# EAGLE design mcb_com14 (EAGLE 5.09)
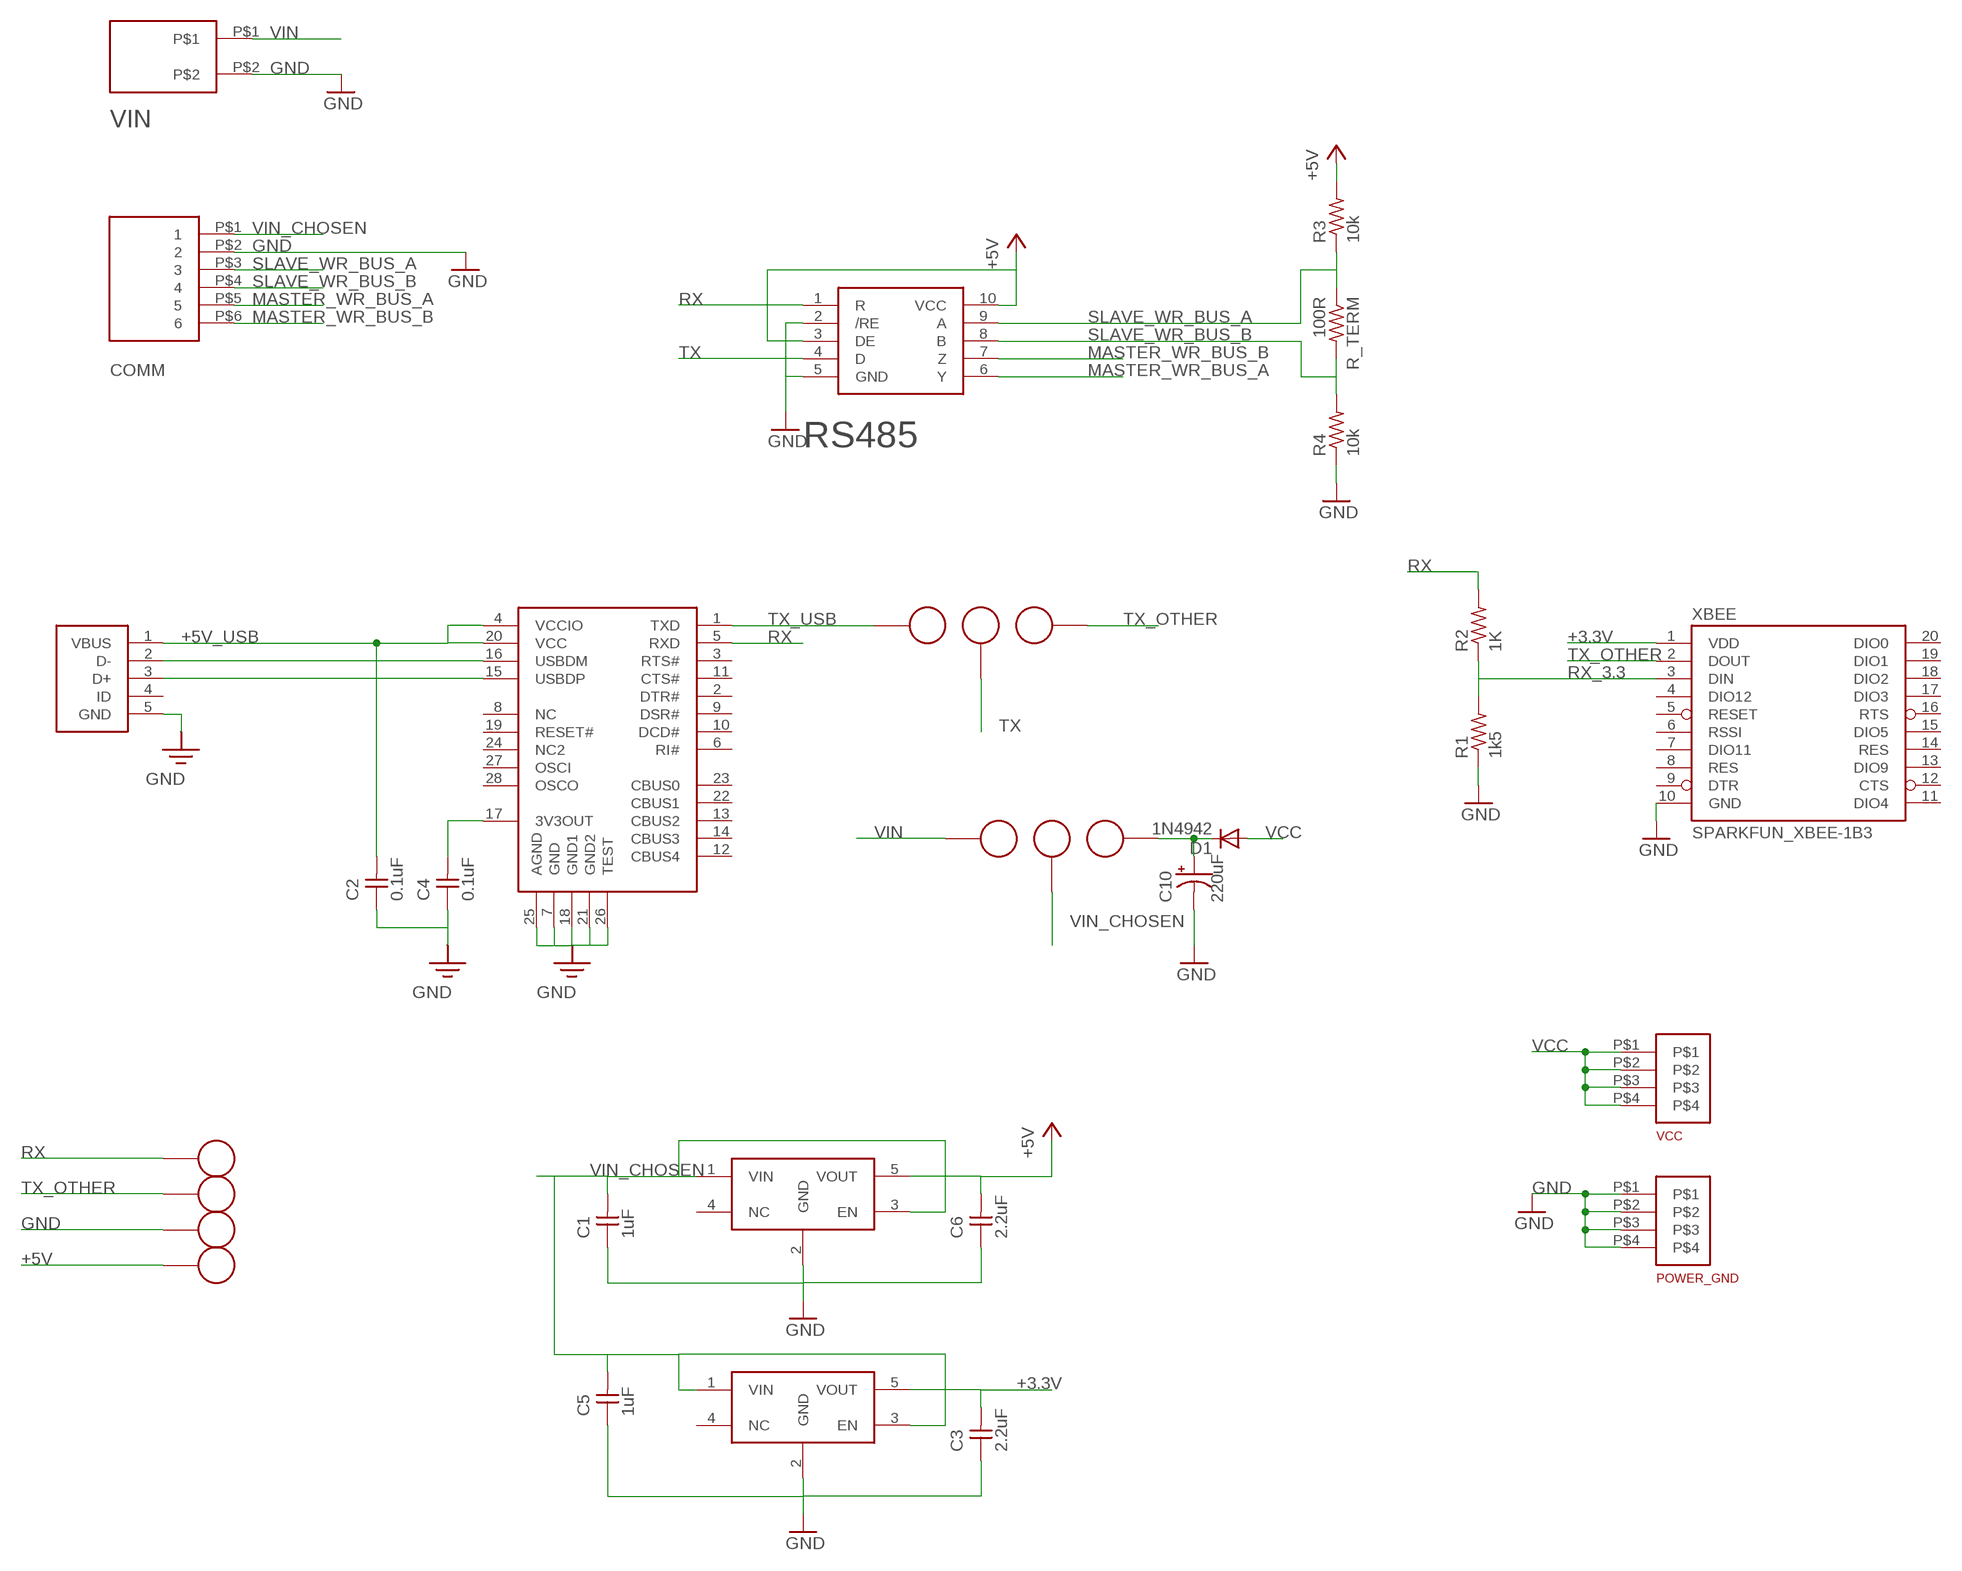
[diagram p0: schematic, sheet 1]

## Parts
3.3V_REG  MIC5235  [SOT-23-5]
5V1  CONNECTOR_TV  [CONNECTOR_TV]
5V_REG  MIC5235  [SOT-23-5]
5V_USB1  CONNECTOR_TV  [CONNECTOR_TV]
5V_VREG1  CONNECTOR_TV  [CONNECTOR_TV]
+5V  CONNECTOR_TV  [CONNECTOR_TV]
C1  1uF  CAPACITOR0805  [0805@1]
C2  0.1uF  CAPACITOR0805  [0805@1]
C3  2.2uF  CAPACITOR0805  [0805@1]
C4  0.1uF  CAPACITOR0805  [0805@1]
C5  1uF  CAPACITOR0805  [0805@1]
C6  2.2uF  CAPACITOR0805  [0805@1]
C10  220uF  CAP-EMVY350ADA221MHA0G  [HAO]
COMM  6PIN-RIBBONCABLE-BOARDHEADER  [6PIN-HEADER-DUALROW]
D1  1N4942  [DO41-10]
FT323R  FT232R  [SSOP-28]
GND  CONNECTOR_TV  [CONNECTOR_TV]
POWER_GND  SCREW_TERMINAL_7700K  [SCREW_TERM_7700K]
R1  1k5  RESISTOR0603  [0603]
R2  1K  RESISTOR0603  [0603]
R3  10k  RESISTOR0603  [0603]
R4  10k  RESISTOR0603  [0603]
R_TERM  100R  RESISTOR0603  [0603]
RS485  RS485-SN65HVD3086EDGSR  [MSOP-10]
RX1  CONNECTOR_TV  [CONNECTOR_TV]
TX  CONNECTOR_TV  [CONNECTOR_TV]
TX1  CONNECTOR_TV  [CONNECTOR_TV]
TX_FTDI  CONNECTOR_TV  [CONNECTOR_TV]
TX_TTL  CONNECTOR_TV  [CONNECTOR_TV]
USB_CONN  MINIUSB  [UX60-MINI-USB]
VCC  SCREW_TERMINAL_7700K  [SCREW_TERM_7700K]
VIN  2PIN-3.81MM-TERMINAL-BLOCK  [2PIN-TERMINAL-BLOCK-SMALLER]
XBEE  SPARKFUN_XBEE-1B3  [SPARKFUN_XBEE-SMD]

## Nets
+3.3V: 3.3V_REG.5(VOUT) C3.2 XBEE.1(VDD)
+5V: 5V_REG.5(VOUT) +5V.P$1 C6.2 R3.2 RS485.3(DE) RS485.10(VCC)
+5V_USB: C2.2 FT323R.4(VCCIO) FT323R.20(VCC) USB_CONN.1(VBUS)
D+: FT323R.15(USBDP) USB_CONN.3(D+)
D-: FT323R.16(USBDM) USB_CONN.2(D-)
GND: 3.3V_REG.2(GND) 5V_REG.2(GND) C1.1 C2.1 C3.1 C4.1 C5.1 C6.1 C10.- COMM.P$2 FT323R.7(GND) FT323R.18(GND1) FT323R.21(GND2) FT323R.25(AGND) FT323R.26(TEST) GND.P$1 POWER_GND.P$1 POWER_GND.P$2 POWER_GND.P$3 POWER_GND.P$4 R1.1 R4.1 RS485.2(/RE) RS485.5(GND) USB_CONN.5(GND) VIN.P$2 XBEE.10(GND)
MASTER_WR_BUS_A: COMM.P$5 RS485.6(Y)
MASTER_WR_BUS_B: COMM.P$6 RS485.7(Z)
N$1: 5V_USB1.P$1 C10.+ D1.C
N$4: C4.2 FT323R.17(3V3OUT)
RX: FT323R.5(RXD) R2.2 RS485.1(R) RX1.P$1
RX_3.3: R1.2 R2.1 XBEE.3(DIN)
SLAVE_WR_BUS_A: COMM.P$3 R3.1 R_TERM.1 RS485.9(A)
SLAVE_WR_BUS_B: COMM.P$4 R4.2 R_TERM.2 RS485.8(B)
TX: RS485.4(D) TX.P$1
TX_OTHER: TX1.P$1 TX_TTL.P$1 XBEE.2(DOUT)
TX_USB: FT323R.1(TXD) TX_FTDI.P$1
VCC: D1.A VCC.P$1 VCC.P$2 VCC.P$3 VCC.P$4
VIN: 5V_VREG1.P$1 VIN.P$1
VIN_CHOSEN: 3.3V_REG.1(VIN) 3.3V_REG.3(EN) 5V1.P$1 5V_REG.1(VIN) 5V_REG.3(EN) C1.2 C5.2 COMM.P$1
Unconnected: 3.3V_REG.4(NC) 5V_REG.4(NC) FT323R.2(DTR#) FT323R.3(RTS#) FT323R.6(RI#) FT323R.8(NC) FT323R.9(DSR#) FT323R.10(DCD#) FT323R.11(CTS#) FT323R.12(CBUS4) FT323R.13(CBUS2) FT323R.14(CBUS3) FT323R.19(RESET#) FT323R.22(CBUS1) FT323R.23(CBUS0) FT323R.24(NC2) FT323R.27(OSCI) FT323R.28(OSCO) USB_CONN.4(ID) XBEE.4(DIO12) XBEE.5(RESET) XBEE.6(RSSI) XBEE.7(DIO11) XBEE.8(RES) XBEE.9(DTR) XBEE.11(DIO4) XBEE.12(CTS) XBEE.13(DIO9) XBEE.14(RES) XBEE.15(DIO5) XBEE.16(RTS) XBEE.17(DIO3) XBEE.18(DIO2) XBEE.19(DIO1) XBEE.20(DIO0)

## Library data of the parts
3.3V_REG 5V_REG = soa:MIC5235
5V1 5V_USB1 5V_VREG1 +5V GND RX1 TX TX1 TX_FTDI TX_TTL = soa:CONNECTOR_TV
C1-C6 = huggable:CAPACITOR
C10 = soa:CAP-EMVY350ADA221MHA0G
COMM = soa:6PIN-RIBBONCABLE-BOARDHEADER
D1 = diode:1N4942: DIODE 1.0 A, 200 V, 150 ns
FT323R = ftdi:FT232R
POWER_GND VCC = soa:SCREW_TERMINAL_7700K
R1-R4 R_TERM = huggable:RESISTOR
RS485 = soa:RS485-SN65HVD3086EDGSR
USB_CONN = usb:MINIUSB
VIN = soa:2PIN-3.81MM-TERMINAL-BLOCK
XBEE = XBee-Explorer-v15:SPARKFUN_XBEE-1

## Board
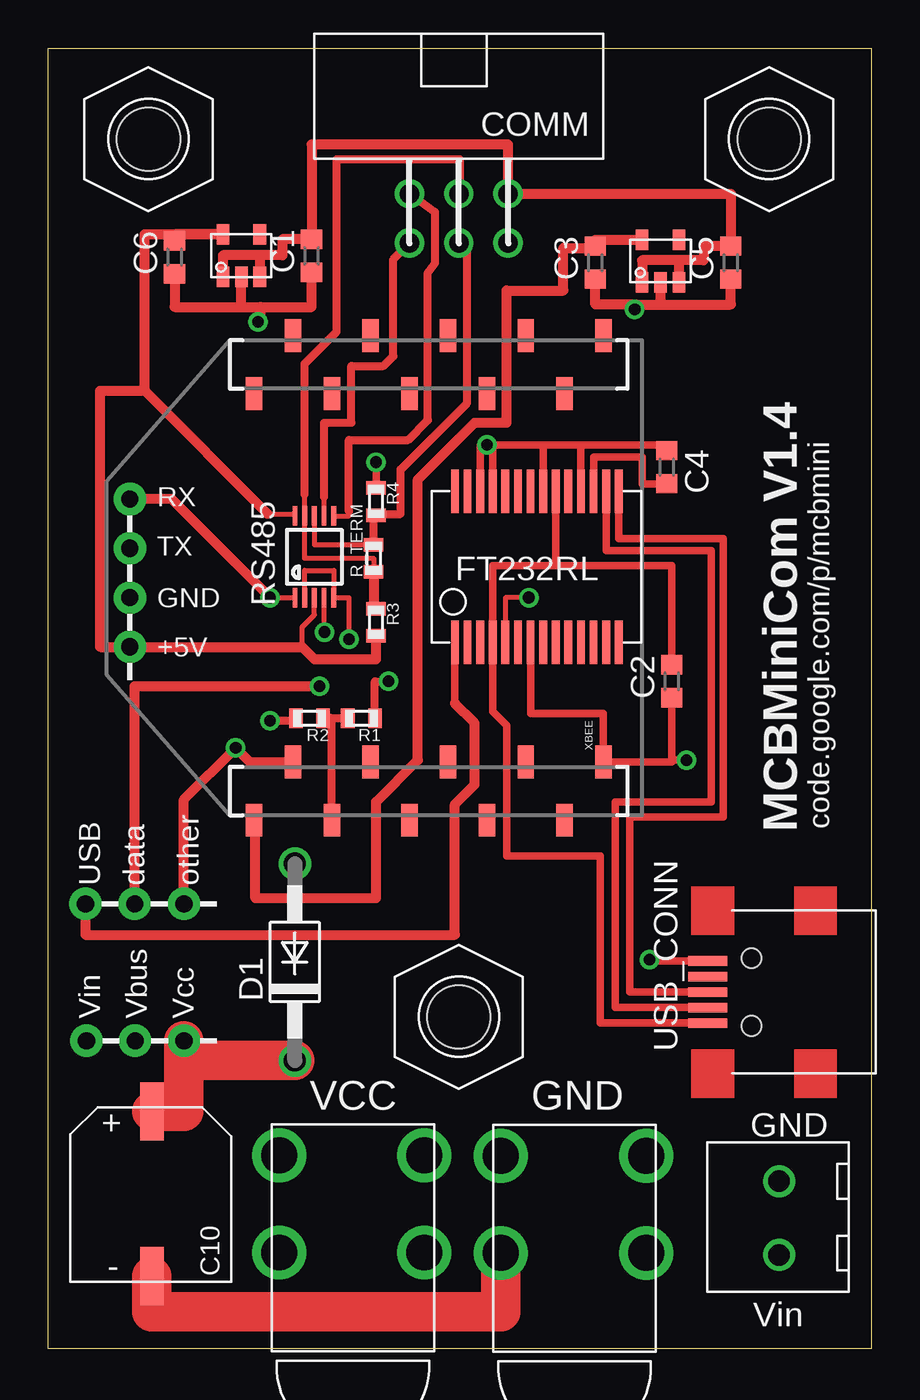
[diagram p1: board, top side]
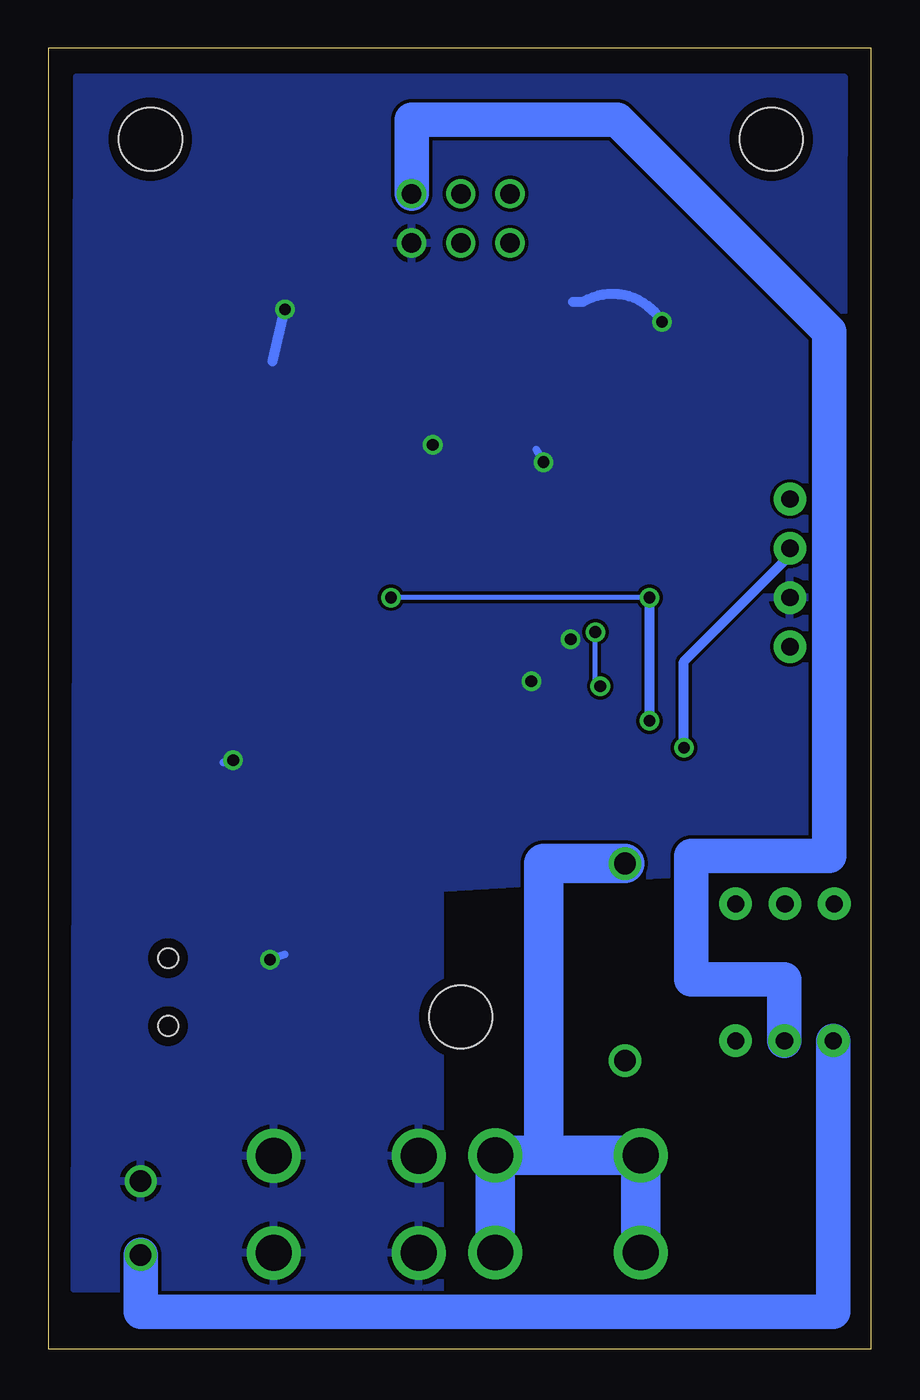
[diagram p2: board, bottom side, seen from below]

Size 42.42 x 67.06 mm. Coordinates in mm from the lower left corner, seen from the top.
Outline: 0,67.06 42.42,67.06 42.42,0 0,0 0,67.06
Copper layers (1*16): signal_top 0.0356mm / dielectric 1.5011mm / gnd 0.0356mm
Design rules "SilverCircuits_DesignRules": minimum track width 7mil, minimum drill 14mil, track to track 7mil, track to pad 7mil, pad to pad 7mil, via to via 7mil, smd to smd 0mil, copper to edge 20mil, drill to drill 8mil, minimum pad ring 10mil, minimum via ring 8mil, stop-mask expansion 4mil, vias tented up to drill 0mil, thermal gap 10mil

### Footprints (pad centres in the part's own frame; a part is rotated, then mirrored left to right if it is on the bottom)
SOT-23-5 = smd 0.65 x 1.06: 1 0,0; 2 0.95,0; 3 1.9,0; 4 1.9,2.2; 5 0,2.2
CONNECTOR_TV = drill 0.889 pad 1.676 round: P$1 0,0
0805@1 = smd 1 x 1.1: 1 -0.85,0; 2 0.85,0
HAO = smd 1.2 x 3: + 0,5; - 0,-3.5
6PIN-HEADER-DUALROW = drill 1 round: P$1 -2.54,0; P$2 -2.54,2.54; P$3 0,0; P$4 0,2.54; P$5 2.54,0; P$6 2.54,2.54
DO41-10 = drill 1.118 round: A 5.08,0; C -5.08,0
SSOP-28 = smd 2.25 x 0.4: 1 0,0; 2 0,-0.65; 3 0,-1.3; 4 0,-1.95; 5 0,-2.6; 6 0,-3.25; 7 0,-3.9; 8 0,-4.55; 9 0,-5.2; 10 0,-5.85; 11 0,-6.5; 12 0,-7.15; 13 0,-7.8; 14 0,-8.45; 15 7.8,-8.45; 16 7.8,-7.8; 17 7.8,-7.15; 18 7.8,-6.5; 19 7.8,-5.85; 20 7.8,-5.2; 21 7.8,-4.55; 22 7.8,-3.9; 23 7.8,-3.25; 24 7.8,-2.6; 25 7.8,-1.95; 26 7.8,-1.3; 27 7.8,-0.65; 28 7.8,0
SCREW_TERM_7700K = drill 1.854 round: P$1 -3.81,2.032; P$2 3.683,2.032; P$3 -3.81,-2.972; P$4 3.683,-2.972
0603 = smd 0.7 x 1: 1 -0.7,0; 2 0.7,0
MSOP-10 = smd 0.25 x 1: 1 -0.88,-2.423; 2 -0.38,-2.423; 3 0.12,-2.423; 4 0.62,-2.423; 5 1.12,-2.423; 6 1.12,1.803; 7 0.62,1.803; 8 0.12,1.803; 9 -0.38,1.803; 10 -0.88,1.803
4-40_NUT_DRILL = hole 3.264: 0,0
UX60-MINI-USB = smd 0.5 x 2: 1 -1.6,2.25; 2 -0.8,2.25; 3 0,2.25; 4 0.8,2.25; 5 1.6,2.25 | hole 1.016: -1.75,0; 1.75,0
2PIN-TERMINAL-BLOCK-SMALLER = drill 1.1 round: P$1 0,0; P$2 3.81,0
SPARKFUN_XBEE-SMD = smd 1.7 x 0.85: 1 -12.5,20; 2 -9.5,18; 3 -12.5,16; 4 -9.5,14; 5 -12.5,12; 6 -9.5,10; 7 -12.5,8; 8 -9.5,6; 9 -12.5,4; 10 -9.5,2; 11 12.5,2; 12 9.5,4; 13 12.5,6; 14 9.5,8; 15 12.5,10; 16 9.5,12; 17 12.5,14; 18 9.5,16; 19 12.5,18; 20 9.5,20

### Placement (x,y rotation side)
3.3V_REG  30.61,54.99 0 top
5V1  4.47,15.88 0 top
5V_REG  8.99,55.27 0 top
5V_USB1  6.99,15.88 0 top
5V_VREG1  1.96,15.88 0 top
+5V  4.19,36.2 270 top
C1  13.56,56.36 90 top
C2  32.13,34.42 90 top
C3  28.19,56.01 90 top
C4  31.88,45.47 270 top
C5  35.18,56.01 90 top
C6  6.5,56.29 90 top
C10  5.33,7.24 0 top
COMM  21.16,59.56 180 top
D1  12.7,19.94 90 top
FT323R  20.96,36.42 90 top
GND  4.19,38.73 270 top
POWER_GND  27,6.96 180 top
R1  16.13,32.51 180 top
R2  13.46,32.51 180 top
R3  16.89,37.46 270 top
R4  16.89,43.69 270 top
R_TERM  16.76,40.77 90 top
RS485  13.59,41.15 0 top
RX1  4.19,43.81 270 top
TX  4.44,22.94 0 top
TX1  4.19,41.27 270 top
TX_FTDI  1.91,22.94 0 top
TX_TTL  6.99,22.94 0 top
U$2  [4-40_NUT_DRILL]  5.16,62.38 0 top
U$3  [4-40_NUT_DRILL]  21.16,17.11 0 top
U$14  [4-40_NUT_DRILL]  37.16,62.38 0 top
USB_CONN  36.25,18.39 90 top
VCC  15.57,6.98 180 top
VIN  37.67,4.83 90 top
XBEE  30.61,39.75 90 top

### Tracks (layer width: path | path; a pad name or v marks a point on that pad's centre or on a via)
+3.3V
  signal_top 0.508: 3.3V_REG.5 28.19,57.19 C3.2 28.19,56.77 26.54,56.77 26.54,54.57 23.62,54.57 23.62,47.75 21.97,47.75 19.05,44.83 19.05,30.35 16.89,28.19 16.89,23.24 10.67,23.24 10.67,27.25 XBEE.1
+5V
  signal_top 0.254: 11.3,43.05 12.61,43.05 RS485.10 | RS485.3 13.71,37.84 13.08,37.21 13.08,36.2
  signal_top 0.508: C6.2 6.5,57.47 5V_REG.5 4.95,57.47 4.95,49.4 | R3.2 16.89,35.56 13.71,35.56 13.08,36.19 13.08,36.2 +5V.P$1 2.67,36.2 2.67,49.4 4.95,49.4 | 4.95,49.4 11.3,43.05
+5V_USB
  signal_top 0.381: 26.16,40.39 22.91,40.39 FT323R.4 22.91,32.85 23.62,32.13 23.62,25.4 28.45,25.4 28.45,16.79 USB_CONN.1 | 26.16,40.39 FT323R.20 | 26.16,40.39 32.13,40.39 C2.2
D+
  signal_top 0.381: FT323R.15 29.41,41.78 34.8,41.78 34.8,27.43 29.97,27.43 29.97,18.39 USB_CONN.3
D-
  signal_top 0.381: FT323R.16 28.76,41.15 34.16,41.15 34.16,28.19 29.21,28.19 29.21,17.59 USB_CONN.2
GND  (via drill 0.6)
  signal_top 0.254: RS485.2 13.21,40.13 14.71,40.13 RS485.5 15.49,38.73 v15.49,36.58
  signal_top 0.381: 32.13,30.35 C2.1 | FT323R.7 24.86,32.77 28.61,32.77 XBEE.10 32.13,30.25 32.13,30.35 | 25.51,46.61 27.45,46.61 | 27.45,46.61 FT323R.18 | 27.45,46.61 31.88,46.61 C4.1 | R4.1 v16.89,45.72 | FT323R.26 22.26,46.61 v22.61,46.61 | FT323R.25 22.91,46.61 v22.61,46.61 | 25.51,46.61 FT323R.21 | v22.61,46.61 25.51,46.61 | 32.13,30.35 v32.89,30.35 | USB_CONN.5 30.99,19.99 v30.99,20.07
  signal_top 0.406: R1.1 16.83,34.42 v17.53,34.42
  signal_top 0.508: C3.1 28.19,53.85 30.29,53.85 | 31.56,53.85 3.3V_REG.2 | 30.29,53.85 31.56,53.85 | v30.23,53.59 30.29,53.85 | C6.1 6.5,53.72 9.94,53.72 | 9.94,53.72 5V_REG.2 | C1.1 13.56,53.72 10.92,53.72 | 9.94,53.72 10.92,53.72 | C5.1 35.18,53.85 31.56,53.85 | v10.8,52.96 10.92,52.96 10.92,53.72
  signal_top 2.032: POWER_GND.P$2 23.32,1.9 5.33,1.9 C10.-
  gnd 0.254: v15.49,36.58 15.37,36.7
  gnd 0.381: v16.89,45.72 17.27,46.35 | v22.61,46.61 22.61,46.86 | v32.89,30.35 32.89,30.23 33.4,30.23 | v30.99,20.07 30.23,20.32
  gnd 0.406: v17.53,34.42 17.53,34.67 17.4,34.67
  gnd 0.508: 30.86,50.93 v30.23,53.59 | v10.8,52.96 arc-90 14.86,53.98 15.37,53.98
  pour gnd: 1.4,65.56 40.97,65.56 41.1,3.1 22.23,2.92 22.23,23.75 1.52,25.02
MASTER_WR_BUS_A
  signal_top 0.254: RS485.6 15.49,42.95 15.49,43.18 | COMM.P$5 18.62,59.49
  signal_top 0.406: 15.49,43.18 15.49,46.86 18.54,46.86 19.56,47.88 19.56,55.5 19.94,56.01 19.94,58.62 COMM.P$5
MASTER_WR_BUS_B
  signal_top 0.254: RS485.7 14.21,43.93
  signal_top 0.406: 14.21,43.93 14.21,47.75 15.62,47.75 15.62,50.67 17.27,50.67 17.78,51.18 17.78,56.18 COMM.P$6
N$1
  signal_top 2.032: 6.99,14.86 D1.C | 6.99,14.86 5V_USB1.P$1 | C10.+ 6.99,12.24 6.99,14.86
N$4
  signal_top 0.381: FT323R.17 28.11,45.97 30.61,45.97 30.61,44.58 31.88,44.58 C4.2
RX  (via drill 0.6)
  signal_top 0.254: FT323R.5 23.55,38.73 v24.77,38.73 | v11.43,38.73 RS485.1
  signal_top 0.406: v11.43,32.38 12.76,32.38 R2.2
  signal_top 0.508: RX1.P$1 6.35,43.81 v11.43,38.73
  gnd 0.254: v11.43,38.73 v24.77,38.73
  gnd 0.508: v11.43,32.38 v11.43,38.73
RX_3.3
  signal_top 0.406: R1.2 R2.1 14.61,32.51 XBEE.3
SLAVE_WR_BUS_A
  signal_top 0.254: R_TERM.1 16.76,40.77 13.21,40.77 RS485.9 13.21,44.07
  signal_top 0.406: 13.21,44.07 13.21,50.8 14.86,52.45 14.86,61.34 21.21,61.34 21.21,59.56 COMM.P$3
  signal_top 0.508: R_TERM.1 16.76,38.29 R3.1
SLAVE_WR_BUS_B
  signal_top 0.254: 16.76,42.99 R4.2 16.96,43.05 | RS485.8 13.71,41.47 R_TERM.2
  signal_top 0.406: COMM.P$4 21.59,56.59 21.59,48.77 18.16,45.34 18.16,43.05 16.96,43.05 | R_TERM.2 16.76,42.86 R4.2
TX  (via drill 0.6)
  signal_top 0.254: RS485.4 14.21,37.34 v14.22,36.96
  signal_top 0.508: v13.97,34.16 4.44,34.16 TX.P$1
  gnd 0.254: v14.22,36.96 14.22,34.16 v13.97,34.16
TX_OTHER  (via drill 0.6)
  signal_top 0.508: XBEE.2 10.39,30.25 v9.65,30.99 6.99,28.32 TX_TTL.P$1
  gnd 0.508: v9.65,30.99 9.65,35.43 4.19,40.89 TX1.P$1
TX_USB
  signal_top 0.381: 20.96,33.27 FT323R.1
  signal_top 0.508: 20.96,33.27 21.97,32.26 21.97,29.08 20.96,28.07 20.96,21.34 1.91,21.34 TX_FTDI.P$1
VCC
  gnd 2.032: VCC.P$1 VCC.P$3 16.89,9.96 | VCC.P$2 VCC.P$4 16.89,9.96 | D1.A 16.89,25.02 16.89,9.96
VIN
  gnd 1.778: VIN.P$1 37.67,1.9 1.96,1.9 5V_VREG1.P$1
VIN_CHOSEN
  signal_top 0.508: 5V_REG.1 8.99,56.39 10.89,56.39 | 10.89,56.39 5V_REG.3 | 10.89,56.39 12.07,56.39 12.07,57.21 C1.2 13.56,62.1 23.7,62.1 COMM.P$1 35.18,59.56 C5.2 33.78,56.86 33.78,56.13 32.51,56.13 | 3.3V_REG.1 30.61,56.13 32.51,56.13 | 32.51,56.13 3.3V_REG.3
  gnd 0.508: 2.16,52.45 7.49,57.79
  gnd 1.778: 5V1.P$1 4.47,19.05 9.27,19.05 9.27,25.4 2.16,25.4 2.16,52.45 13.08,63.37 23.7,63.37 COMM.P$1

### Text on the board
_tsilk: RX | TX | GND | +5V | MCBMiniCom V1.4 | code.google.com/p/mcbmini | USB | data | other | Vin | Vbus | Vcc | VCC | GND | GND | Vin